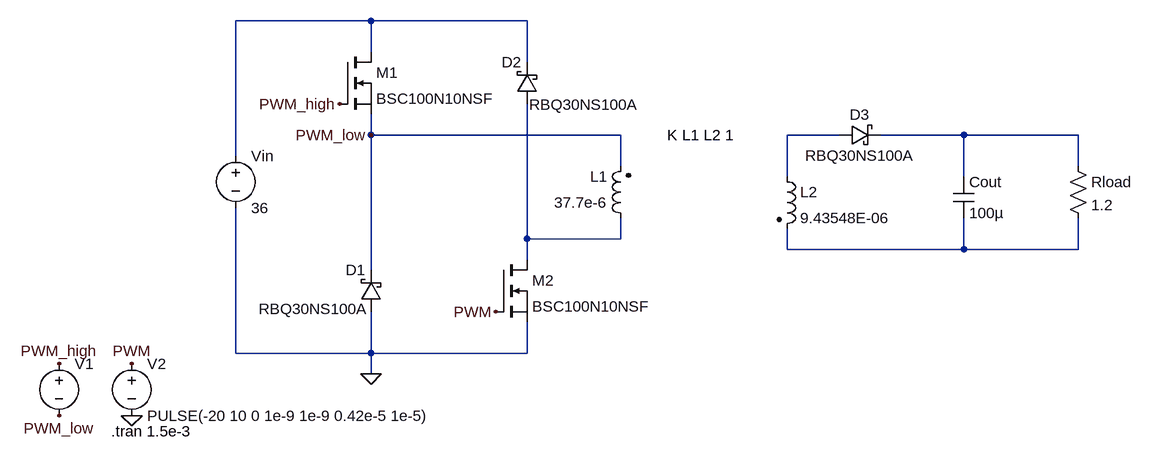
[diagram p0: schematic Draft1.asc]
Draft1.asc, the LTspice schematic file:
Version 4
SHEET 1 1176 680
WIRE 0 -96 -208 -96
WIRE 240 -96 0 -96
WIRE 0 -48 0 -96
WIRE 240 -32 240 -96
WIRE 0 80 0 48
WIRE 384 80 0 80
WIRE 720 80 640 80
WIRE 912 80 784 80
WIRE 1088 80 912 80
WIRE -208 112 -208 -96
WIRE 384 128 384 80
WIRE 1088 128 1088 80
WIRE 640 144 640 80
WIRE 912 144 912 80
WIRE 240 240 240 32
WIRE 384 240 384 208
WIRE 384 240 240 240
WIRE 640 256 640 224
WIRE 912 256 912 208
WIRE 912 256 640 256
WIRE 1088 256 1088 208
WIRE 1088 256 912 256
WIRE 240 272 240 240
WIRE 0 288 0 80
WIRE -208 416 -208 192
WIRE 0 416 0 352
WIRE 0 416 -208 416
WIRE 240 416 240 368
WIRE 240 416 0 416
WIRE 0 448 0 416
FLAG 0 448 0
FLAG -368 512 0
FLAG 192 352 PWM
FLAG -368 432 PWM
FLAG -480 432 PWM_high
FLAG -480 512 PWM_low
FLAG 0 80 PWM_low
FLAG -48 32 PWM_high
SYMBOL ind2 400 224 R180
WINDOW 0 36 80 Left 2
WINDOW 3 36 40 Left 2
SYMATTR InstName L1
SYMATTR Value 37.7e-6
SYMATTR Type ind
SYMBOL ind2 624 128 R0
SYMATTR InstName L2
SYMATTR Value 9.43548E-06
SYMATTR Type ind
SYMBOL voltage -208 96 R0
SYMATTR InstName Vin
SYMATTR Value 36
SYMBOL nmos -48 -48 R0
SYMATTR InstName M1
SYMATTR Value BSC100N10NSF
SYMBOL nmos 192 272 R0
SYMATTR InstName M2
SYMATTR Value BSC100N10NSF
SYMBOL schottky 256 32 R180
WINDOW 0 24 64 Left 2
WINDOW 3 -155 -1 Left 2
SYMATTR InstName D2
SYMATTR Value RBQ30NS100A
SYMATTR Description Diode
SYMATTR Type diode
SYMBOL schottky 720 96 R270
WINDOW 0 32 32 VTop 2
WINDOW 3 0 32 VBottom 2
SYMATTR InstName D3
SYMATTR Value RBQ30NS100A
SYMATTR Description Diode
SYMATTR Type diode
SYMBOL cap 896 144 R0
SYMATTR InstName Cout
SYMATTR Value 100µ
SYMBOL res 1072 112 R0
SYMATTR InstName Rload
SYMATTR Value 1.2
SYMBOL voltage -368 416 R0
WINDOW 123 0 0 Left 0
WINDOW 39 0 0 Left 0
SYMATTR InstName V2
SYMATTR Value PULSE(-20 10 0 1e-9 1e-9 0.42e-5 1e-5)
SYMBOL voltage -480 416 R0
WINDOW 123 0 0 Left 0
WINDOW 39 0 0 Left 0
WINDOW 3 24 96 Invisible 2
SYMATTR InstName V1
SYMATTR Value PULSE(-20 10 0 1e-9 1e-9 0.42e-5 1e-5)
SYMBOL schottky 16 352 R180
WINDOW 0 24 64 Left 2
WINDOW 3 21 4 Left 2
SYMATTR InstName D1
SYMATTR Value RBQ30NS100A
SYMATTR Description Diode
SYMATTR Type diode
TEXT -400 536 Left 2 !.tran 1.5e-3
TEXT 456 80 Left 2 !K L1 L2 1

The netlist it stands for:
* Draft1.asc
L1 N004 PWM_low 37.7e-6
L2 N002 N005 9.43548E-06
Vin N001 0 36
M1 N001 PWM_high PWM_low PWM_low BSC100N10NSF
M2 N004 PWM 0 0 BSC100N10NSF
D2 N004 N001 RBQ30NS100A
D3 N002 N003 RBQ30NS100A
Cout N003 N005 100µ
Rload N003 N005 1.2
V2 PWM 0 PULSE(-20 10 0 1e-9 1e-9 0.42e-5 1e-5)
V1 PWM_high PWM_low PULSE(-20 10 0 1e-9 1e-9 0.42e-5 1e-5)
D1 0 PWM_low RBQ30NS100A
.model D D
.lib standard.dio
.model NMOS NMOS
.model PMOS PMOS
.lib standard.mos
.tran 1.5e-3
K L1 L2 1
.backanno
.end